# Altium schematic sheet omnibothub-debug.SchDoc
size A4
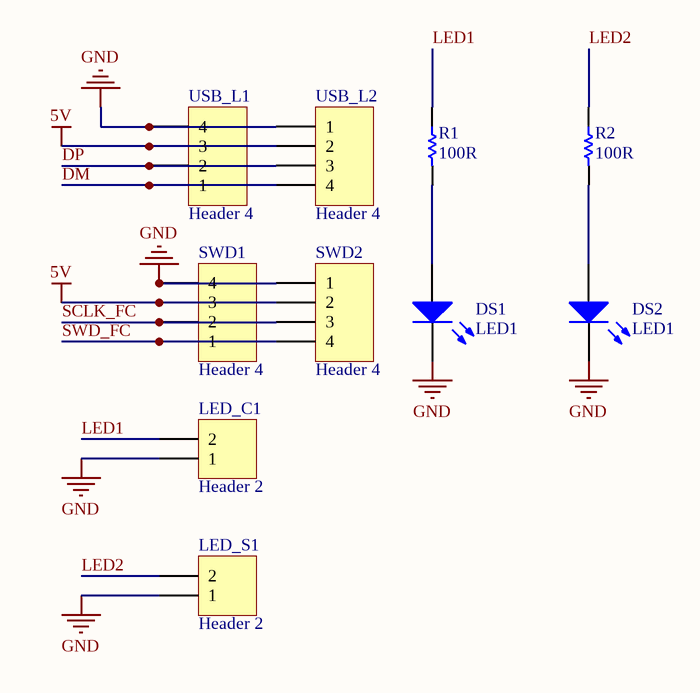
[diagram p0: omnibothub-debug.SchDoc]

## Parts
DS1  LED1  [SMDLED]
DS2  LED1  [SMDLED]
LED_C1  Header 2  [GH1.25-2P]
LED_S1  Header 2  [GH1.25-2P]
R1  100R  [R 0402]
R2  100R  [R 0402]
SWD1  Header 4  [SH1.0-4P - up]
SWD2  Header 4  [SH1.0-4P - up]
USB_L1  Header 4  [SH1.0-4P - up]
USB_L2  Header 4  [SH1.0-4P - up]

## Nets
5V: SWD1.3 SWD2.2 USB_L1.3 USB_L2.2
GND: DS1.2(K) DS2.2(K) LED_C1.1 LED_S1.1 SWD1.4 SWD2.1 USB_L1.4 USB_L2.1
DM: USB_L1.1 USB_L2.4
DP: USB_L1.2 USB_L2.3
LED1: LED_C1.2 R1.1
LED2: LED_S1.2 R2.1
SCLK_FC: SWD1.2 SWD2.3
SWD_FC: SWD1.1 SWD2.4
NetDS1_1: DS1.1(A) R1.2
NetDS2_1: DS2.1(A) R2.2

## Library data of the parts
DS1 DS2 = LED2: Typical RED, GREEN, YELLOW, AMBER GaAs LED; Published: 8-Jun-2000; LatestRevisionDate: 17-Jul-2002; LatestRevisionNote: Re-released for DXP Platform.; PackageDocument: Feb-2002; PackageReference: 3.2X1.6X1.1; Publisher: Altium Limited
LED_C1 LED_S1 = Header 2: Header, 2-Pin; LatestRevisionDate: 17-Jul-2002; LatestRevisionNote: Re-released for DXP Platform.; Publisher: Altium Limited
R1 R2 = Res2: 0603
SWD1 SWD2 USB_L1 USB_L2 = Header 4: Header, 4-Pin; LatestRevisionDate: 17-Jul-2002; LatestRevisionNote: Re-released for DXP Platform.; Publisher: Altium Limited